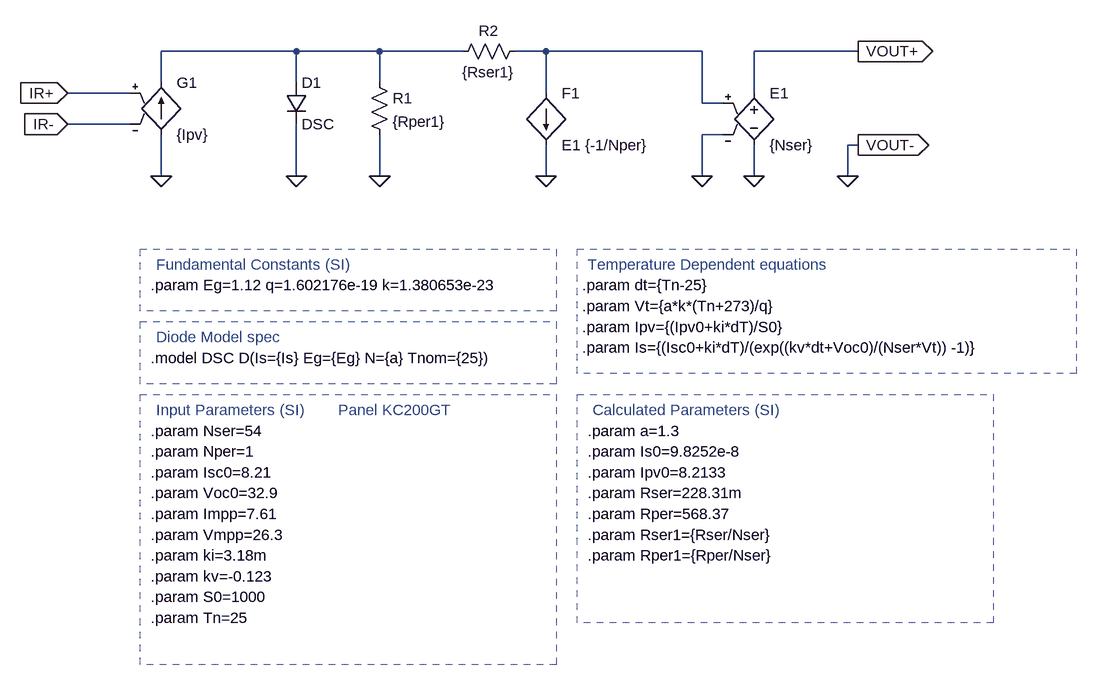
[diagram p0: schematic SolarPanel.asc]
SolarPanel.asc, the LTspice schematic file:
Version 4.1
SHEET 1 1364 1044
WIRE 160 96 -48 96
WIRE 288 96 160 96
WIRE 416 96 288 96
WIRE 544 96 496 96
WIRE 784 96 544 96
WIRE 1024 96 864 96
WIRE -48 144 -48 96
WIRE 160 144 160 96
WIRE 288 144 288 96
WIRE -96 160 -192 160
WIRE 544 160 544 96
WIRE 864 160 864 96
WIRE 784 176 784 96
WIRE 816 176 784 176
WIRE -96 208 -192 208
WIRE 816 224 784 224
WIRE 1024 240 1008 240
WIRE -48 288 -48 224
WIRE 160 288 160 208
WIRE 288 288 288 224
WIRE 544 288 544 240
WIRE 784 288 784 224
WIRE 864 288 864 240
WIRE 1008 288 1008 240
FLAG -48 288 0
FLAG -192 160 IR+
IOPIN -192 160 In
FLAG -192 208 IR-
IOPIN -192 208 In
FLAG 864 288 0
FLAG 288 288 0
FLAG 160 288 0
FLAG 784 288 0
FLAG 1008 288 0
FLAG 1024 96 VOUT+
IOPIN 1024 96 Out
FLAG 1024 240 VOUT-
IOPIN 1024 240 Out
FLAG 544 288 0
SYMBOL g -48 128 R0
SYMATTR InstName G1
SYMATTR Value {Ipv}
SYMBOL diode 144 144 R0
SYMATTR InstName D1
SYMATTR Value DSC
SYMBOL res 272 128 R0
SYMATTR InstName R1
SYMATTR Value {Rper1}
SYMBOL res 512 80 R90
WINDOW 0 0 56 VBottom 2
WINDOW 3 32 56 VTop 2
SYMATTR InstName R2
SYMATTR Value {Rser1}
SYMBOL e 864 144 R0
SYMATTR InstName E1
SYMATTR Value {Nser}
SYMBOL f 544 160 R0
SYMATTR InstName F1
SYMATTR Value E1 {-1/Nper}
TEXT -64 456 Left 2 !.param Eg=1.12 q=1.602176e-19 k=1.380653e-23
TEXT -56 424 Left 2 ;Fundamental Constants (SI)
TEXT -64 568 Left 2 !.model DSC D(Is={Is} Eg={Eg} N={a} Tnom={25})
TEXT 600 456 Left 2 !.param dt={Tn-25}
TEXT 608 424 Left 2 ;Temperature Dependent equations
TEXT 600 488 Left 2 !.param Vt={a*k*(Tn+273)/q}
TEXT 600 520 Left 2 !.param Ipv={(Ipv0+ki*dT)/S0}
TEXT 600 552 Left 2 !.param Is={(Isc0+ki*dT)/(exp((kv*dt+Voc0)/(Nser*Vt)) -1)}
TEXT -64 680 Left 2 !.param Nser=54
TEXT -56 648 Left 2 ;Input Parameters (SI)
TEXT -56 536 Left 2 ;Diode Model spec
TEXT -64 712 Left 2 !.param Nper=1
TEXT -64 744 Left 2 !.param Isc0=8.21
TEXT -64 776 Left 2 !.param Voc0=32.9
TEXT -64 808 Left 2 !.param Impp=7.61
TEXT -64 840 Left 2 !.param Vmpp=26.3
TEXT -64 872 Left 2 !.param ki=3.18m
TEXT -64 904 Left 2 !.param kv=-0.123
TEXT -64 936 Left 2 !.param S0=1000
TEXT 608 680 Left 2 !.param a=1.3
TEXT 616 648 Left 2 ;Calculated Parameters (SI)
TEXT 608 712 Left 2 !.param Is0=9.8252e-8
TEXT 608 744 Left 2 !.param Ipv0=8.2133
TEXT 608 776 Left 2 !.param Rser=228.31m
TEXT 608 808 Left 2 !.param Rper=568.37
TEXT 608 840 Left 2 !.param Rser1={Rser/Nser}
TEXT 608 872 Left 2 !.param Rper1={Rper/Nser}
TEXT -64 968 Left 2 !.param Tn=25
TEXT 224 648 Left 2 ;Panel KC200GT
RECTANGLE Normal 560 496 -80 400 2
RECTANGLE Normal 1360 592 592 400 2
RECTANGLE Normal 560 608 -80 512 2
RECTANGLE Normal 1232 976 592 624 2
RECTANGLE Normal 560 1040 -80 624 2

The netlist it stands for:
* SolarPanel.asc
G1 0 N001 IR+ IR- {Ipv}
D1 N001 0 DSC
R1 N001 0 {Rper1}
R2 N002 N001 {Rser1}
E1 VOUT+ 0 N002 0 {Nser}
F1 N002 0 E1 {-1/Nper}
.model D D
.lib standard.dio
.param Eg=1.12 q=1.602176e-19 k=1.380653e-23
* Fundamental Constants (SI)
.model DSC D(Is={Is} Eg={Eg} N={a} Tnom={25})
.param dt={Tn-25}
* Temperature Dependent equations
.param Vt={a*k*(Tn+273)/q}
.param Ipv={(Ipv0+ki*dT)/S0}
.param Is={(Isc0+ki*dT)/(exp((kv*dt+Voc0)/(Nser*Vt)) -1)}
.param Nser=54
* Input Parameters (SI)
* Diode Model spec
.param Nper=1
.param Isc0=8.21
.param Voc0=32.9
.param Impp=7.61
.param Vmpp=26.3
.param ki=3.18m
.param kv=-0.123
.param S0=1000
.param a=1.3
* Calculated Parameters (SI)
.param Is0=9.8252e-8
.param Ipv0=8.2133
.param Rser=228.31m
.param Rper=568.37
.param Rser1={Rser/Nser}
.param Rper1={Rper/Nser}
.param Tn=25
* Panel KC200GT
.backanno
.end